# EAGLE design MicroWordClock2_60mm (EAGLE 9.6.2)
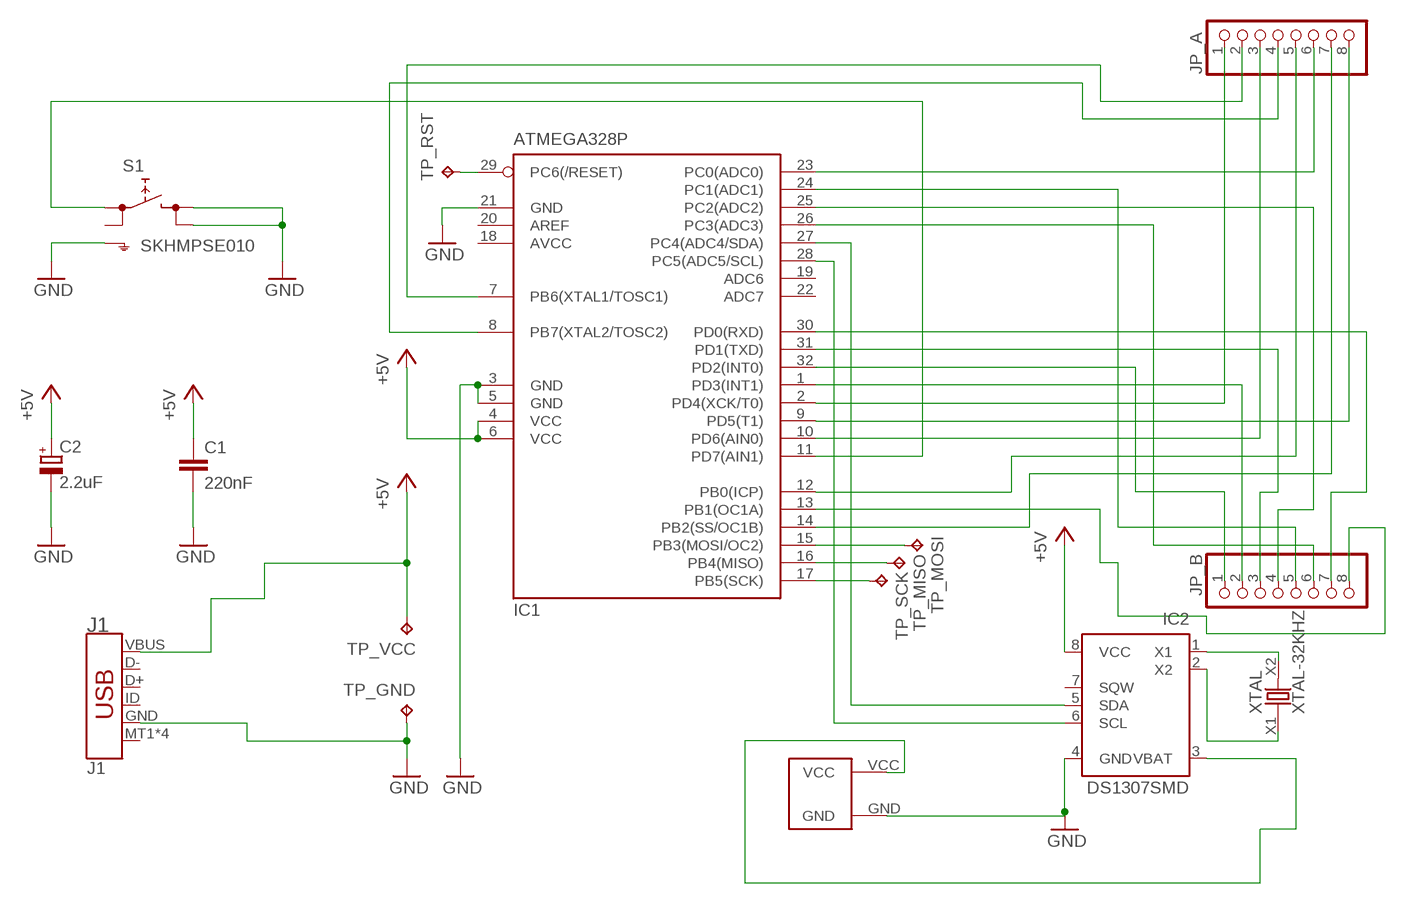
[diagram p0: schematic, sheet 1]

## Parts
C1  220nF  C-EUC0805  [C0805]
C2  2.2uF  CPOL-EUB/3528-21R  [B/3528-21R]
IC1  ATMEGA328P  MEGA8-AI  [TQFP32-08]
IC2  DS1307SMD  [SO-08M]
J1  J1  USB_MICRO-B_SMT  [USB-MICROB]
JP_A  PINHD-1X8CLEANBIG  [1X08-CLEANBIG]
JP_B  PINHD-1X8CLEANBIG  [1X08-CLEANBIG]
S1  SKHMPSE010  [SKHMPXE010]
TP_GND  TPB1,27  [B1,27]
TP_MISO  TPB1,27  [B1,27]
TP_MOSI  TPB1,27  [B1,27]
TP_RST  TPB1,27  [B1,27]
TP_SCK  TPB1,27  [B1,27]
TP_VCC  TPB1,27  [B1,27]
U$1  CR2032  [CR2032-20MM]
XTAL  XTAL-32KHZ  [XTAL-SMD-1206-3216M]

## Nets
+5V: C1.1 C2.+ IC1.4(VCC) IC1.6(VCC) IC2.8(VCC) J1.VBUS TP_VCC.TP
A7: IC1.10(PD6(AIN0)) JP_A.3
A8: IC1.8(PB7(XTAL2/TOSC2)) JP_A.4
B8: IC1.7(PB6(XTAL1/TOSC1)) JP_A.2
GND: C1.2 C2.- IC1.3(GND) IC1.5(GND) IC1.21(GND) IC2.4(GND) J1.GND S1.3(2.1) S1.4(2.2) S1.5(SH) TP_GND.TP U$1.GND
MISO: IC1.16(PB4(MISO)) TP_MISO.TP
MOSI: IC1.15(PB3(MOSI/OC2)) TP_MOSI.TP
N$1: IC1.12(PB0(ICP)) JP_A.5
N$2: IC2.2(X2) XTAL.X1
N$3: IC1.2(PD4(XCK/T0)) JP_A.1
N$4: IC1.23(PC0(ADC0)) JP_A.6
N$5: IC1.14(PB2(SS/OC1B)) JP_A.7
N$6: IC1.9(PD5(T1)) JP_A.8
N$7: IC1.32(PD2(INT0)) JP_B.1
N$8: IC1.1(PD3(INT1)) JP_B.2
N$9: IC1.31(PD1(TXD)) JP_B.3
N$10: IC1.25(PC2(ADC2)) JP_B.4
N$11: IC2.3(VBAT) U$1.VCC
N$12: IC1.24(PC1(ADC1)) JP_B.5
N$13: IC1.26(PC3(ADC3)) JP_B.6
N$14: IC2.1(X1) XTAL.X2
N$15: IC1.30(PD0(RXD)) JP_B.7
N$16: IC1.13(PB1(OC1A)) JP_B.8
N$18: IC1.28(PC5(ADC5/SCL)) IC2.6(SCL)
RESET: IC1.29(PC6(/RESET)) TP_RST.TP
SCK: IC1.17(PB5(SCK)) TP_SCK.TP
SDA: IC1.27(PC4(ADC4/SDA)) IC2.5(SDA)
SWITCH: IC1.11(PD7(AIN1)) S1.1(1.1)
Unconnected: IC1.19(ADC6) IC1.20(AREF) IC1.22(ADC7) IC2.7(SQW) J1.D+ J1.D- J1.ID J1.MT1(SHIELD) J1.MT2(SHIELD) J1.P$1(SHIELD) J1.P$2(SHIELD) S1.2(1.2)

## Power pins joined to a net without a drawn wire
AVCC: IC1.18(AVCC)

## Library data of the parts
C1 = rcl:C-EU: CAPACITOR, European symbol
C2 = rcl:CPOL-EU: POLARIZED CAPACITOR, European symbol
IC1 = atmel:MEGA8: MICROCONTROLLER 8 Kbytes FLASH, 1 kbytes SRAM, 512 bytes EEPROM, USART, 6-channel 10 bit ADC, 2-channel 8 bit ADC Pin compatible with Atmega48, ATMega88, ATMega168 Source: avr.lbr; MPN: ATMEGA8-16AU; OC_FARNELL: 9171371; OC_NEWARK: 73M8863
IC2 = DS1307:DS1307: DS1307 - 64×8, Serial, I2C Real Time Clock
J1 = SparkFun-Connectors:USB_MICRO-B: USB Type Micro-B Connector Male/female and PTH/SMT variants SparkFun Products: SparkFun microB USB Breakout <https://www.sparkfun.com/products/12035> SparkFun USB microB Plug Breakout <https://www.sparkfun.com/products/10031> SparkFun ESP8266 Thing <https://www.sparkfun.com/products/13231>; PROD_ID: CONN-09505; SF_ID: PRT-08533
JP_A JP_B = adafruit:PINHD-1X8: PIN HEADER
S1 = switch:SKHMP*E010: 6.2 X 6.5mm TACT Switch (SMD) Source: http://www3.alps.co.jp/WebObjects/catalog.woa/PDF/E/Switch/Tact/SKHM/SKHM.PDF
TP_GND TP_MISO TP_MOSI TP_RST TP_SCK TP_VCC = testpad:TP: Test pad
U$1 = cr2032:CR2032
XTAL = xtal-32khz:XTAL-32KHZ

## Board
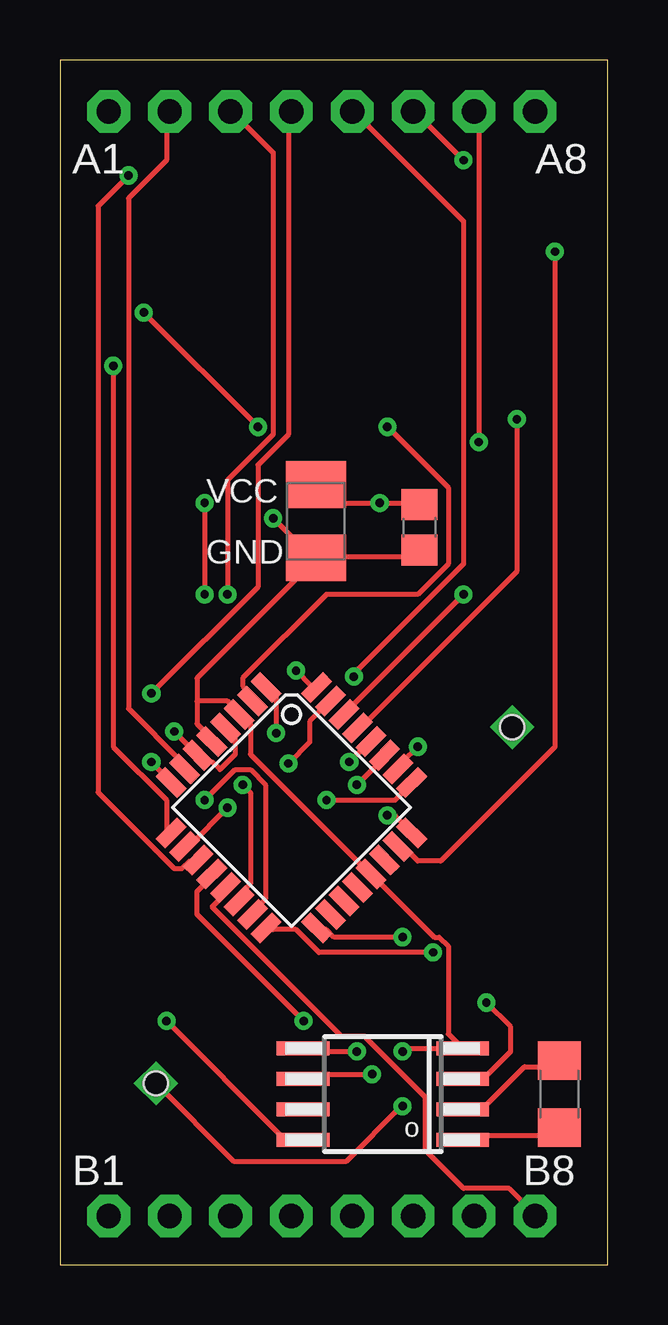
[diagram p1: board, top side]
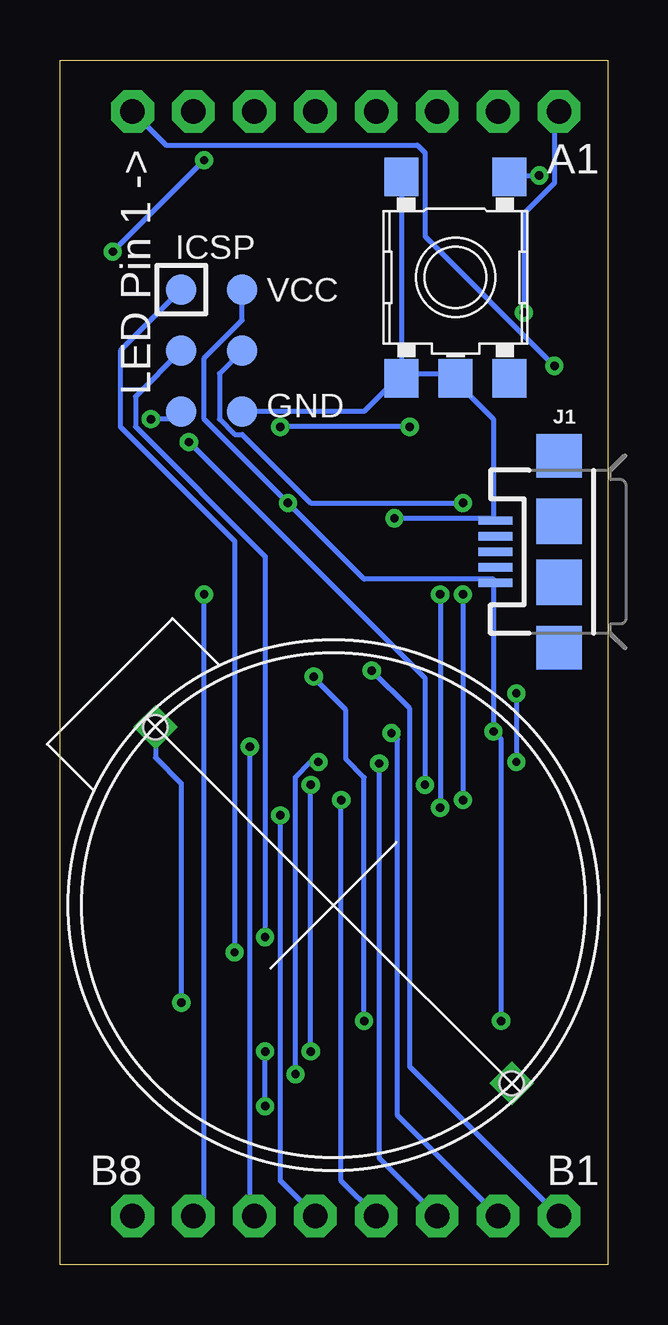
[diagram p2: board, bottom side, seen from below]

Size 22.84 x 50.22 mm. Coordinates in mm from the lower left corner, seen from the top.
Outline: 0,0 22.84,0 22.84,50.22 0,50.22 0,0
Copper layers (1*16): Top 0.035mm / dielectric 1.5mm / Bottom 0.035mm
Design rules "default *": minimum track width 8mil, minimum drill 0.35mm, track to track 6mil, track to pad 6mil, pad to pad 6mil, via to via 6mil, smd to smd 6mil, copper to edge 40mil, drill to drill 6mil, minimum pad ring 10mil, minimum via ring 8mil, stop-mask expansion 4mil, vias tented up to drill 0mil, thermal gap 10mil

### Footprints (pad centres in the part's own frame; a part is rotated, then mirrored left to right if it is on the bottom)
C0805 = smd 1.3 x 1.5: 1 -0.95,0; 2 0.95,0
B/3528-21R = smd 1.95 x 2.5: + 1.525,0; - -1.525,0
TQFP32-08 = smd 1.27 x 0.559: 1 -4.293,2.8; 2 -4.293,2; 3 -4.293,1.2; 4 -4.293,0.4; 5 -4.293,-0.4; 6 -4.293,-1.2; 7 -4.293,-2; 8 -4.293,-2.8; 17 4.293,-2.8; 18 4.293,-2; 19 4.293,-1.2; 20 4.293,-0.4; 21 4.293,0.4; 22 4.293,1.2; 23 4.293,2; 24 4.293,2.8 | smd 0.559 x 1.27: 9 -2.8,-4.293; 10 -2,-4.293; 11 -1.2,-4.293; 12 -0.4,-4.293; 13 0.4,-4.293; 14 1.2,-4.293; 15 2,-4.293; 16 2.8,-4.293; 25 2.8,4.293; 26 2,4.293; 27 1.2,4.293; 28 0.4,4.293; 29 -0.4,4.293; 30 -1.2,4.293; 31 -2,4.293; 32 -2.8,4.293
SO-08M = smd 0.6 x 2.2: 1 -1.905,-3.33; 2 -0.635,-3.33; 3 0.635,-3.33; 4 1.905,-3.33; 5 1.905,3.33; 6 0.635,3.33; 7 -0.635,3.33; 8 -1.905,3.33
USB-MICROB = smd 1.4 x 0.35: D+ -2.65,0; D- -2.65,-0.65; GND -2.65,1.3; ID -2.65,0.65; VBUS -2.65,-1.3 | smd 1.9 x 1.8: MT1 0,-4; MT2 0,4 | smd 1.9 x 1.9: P$1 0,-1.27; P$2 0,1.27
1X08-CLEANBIG = drill 1.016 pad 1.778 octagon: 1 -8.89,0; 2 -6.35,0; 3 -3.81,0; 4 -1.27,0; 5 1.27,0; 6 3.81,0; 7 6.35,0; 8 8.89,0
SKHMPXE010 = smd 1.6 x 1.4: 1 -4.2,2.25; 2 4.2,2.25; 3 -4.2,-2.25; 4 4.2,-2.25; 5 4.2,0
B1,27 = smd 1.27 x 1.27: TP 0,0
CR2032-20MM = drill 0.8 square: GND 0,10.5; VCC 0,-10.5 | hole 1: 0,10.5; 0,-10.5
XTAL-SMD-1206-3216M = smd 1.6 x 1.8: X1 -1.4,0; X2 1.4,0

### Placement (x,y rotation side)
C1  14.99,30.73 270 top
C2  10.67,30.99 90 top
IC1  9.65,19.05 315 top
IC2  13.46,7.11 90 top
J1  2.03,29.72 0 bottom
JP_A  10.92,48.07 0 top
JP_B  10.92,2.03 0 top
S1  6.35,41.15 270 bottom
TP_GND  15.24,35.56 0 bottom
TP_MISO  17.78,40.64 0 bottom
TP_MOSI  15.24,38.1 0 bottom
TP_RST  17.78,35.56 0 bottom
TP_SCK  17.78,38.1 0 bottom
TP_VCC  15.24,40.64 0 bottom
U$1  11.43,14.99 225 bottom
XTAL  20.83,7.11 270 top

### Tracks (layer width: path | path; a pad name or v marks a point on that pad's centre or on a via)
+5V  (via drill 0.35)
  Top 0.203: C1.1 14.92,31.75 v13.34,31.75 11.43,31.75 10.79,32.38 C2.+ | IC1.4 6.99,22.23 7.3,21.91 7.3,21.27 6.67,20.64 6.35,20.95 6.03,20.95 IC1.6 5.71,21.27 v4.76,22.23 | v4.45,10.16 9.21,5.4 9.84,5.4 IC2.8
  Bottom 0.203: TP_VCC.TP 15.24,39.37 16.83,37.78 16.83,35.24 v13.34,31.75 10.16,28.57 4.76,28.57 J1.VBUS 4.76,28.26 v4.76,22.23 4.45,21.91 v4.45,10.16
A7  (via drill 0.35)
  Top 0.203: v6.99,19.05 5.4,17.46 IC1.10 | v6.99,27.94 6.99,32.7 8.89,34.61 8.89,46.35 7.3,47.94 JP_A.3
  Bottom 0.203: v6.99,27.94 v6.99,19.05
A8  (via drill 0.35)
  Top 0.203: v3.81,20.95 4.45,20.32 IC1.8 | v3.81,23.81 8.26,28.26 8.26,33.34 9.53,34.61 9.53,47.94 JP_A.4
  Bottom 0.203: v3.81,23.81 v3.81,20.95
B8
  Top 0.203: IC1.7 5.08,20.95 2.86,23.18 2.86,44.45 4.45,46.04 4.45,47.94 JP_A.2
GND  (via drill 0.35)
  Top 0.203: 5.71,23.5 5.71,24.45 10.48,29.21 C2.- | 5.71,23.5 5.71,22.54 6.03,22.23 6.03,21.91 IC1.5 | C1.2 14.92,29.53 10.79,29.53 C2.- | 5.71,23.5 6.99,23.5 7.3,23.18 IC1.3 7.62,22.86 7.94,22.54 7.94,21.27 12.7,16.51 IC1.21 15.62,13.65 15.82,13.65 16.19,13.28 16.19,9.62 IC2.4 14.41,9.02 v14.29,8.89 | v8.89,31.11 10.48,29.53 C2.- | U$1.GND 7.25,4.32 11.94,4.32 14.22,6.6 v14.29,6.6
  Bottom 0.203: 4.76,31.11 4.76,35.24 6.35,36.83 S1.5 6.35,37.15 8.57,37.15 | TP_GND.TP 10.16,35.56 8.89,36.83 S1.4 8.57,37.15 | 8.57,37.15 8.57,45.09 S1.3 | v8.89,31.11 4.76,31.11 | 4.76,31.11 J1.GND | v14.29,6.6 v14.29,8.89
MISO  (via drill 0.35)
  Top 0.203: v15.56,13.02 10.79,13.02 9.84,13.97 8.89,13.97 IC1.16
  Bottom 0.203: v15.56,13.02 15.56,30.16 20.32,34.92 20.32,38.1 TP_MISO.TP
MOSI  (via drill 0.35)
  Top 0.203: v6.03,19.37 7.3,20.64 7.94,20.64 8.57,20 8.57,15.24 8.26,14.92 8.26,14.61 IC1.15 | v6.03,31.75 v6.03,27.94
  Bottom 0.203: v6.03,27.94 v6.03,19.37 | v6.03,31.75 12.38,31.75 15.24,34.61 15.56,34.61 16.19,35.24 16.19,37.15 TP_MOSI.TP
N$1  (via drill 0.35)
  Top 0.203: v10.16,10.16 5.71,14.61 5.71,15.56 6.03,15.88 6.03,16.19 IC1.12 | v12.26,24.51 12.26,24.64 16.83,29.21 16.83,43.5 12.38,47.94 JP_A.5
  Bottom 0.203: v10.16,10.16 10.16,20.32 10.92,21.08 10.92,23.11 12.19,24.38 12.19,24.45 v12.26,24.51
N$2
  Top 0.203: XTAL.X1 20.64,8.26 19.37,8.26 17.78,6.67 16.83,6.67 IC2.2
N$3  (via drill 0.35)
  Top 0.203: v13.65,34.92 16.19,32.38 16.19,29.21 14.92,27.94 11.11,27.94 7.62,24.45 7.62,24.13 7.94,23.81 IC1.2 | v3.49,39.69 v8.26,34.92
  Bottom 0.203: v8.26,34.92 v13.65,34.92 | v3.49,39.69 3.49,43.81 2.22,45.09 2.22,47.94 JP_A.1
N$4  (via drill 0.35)
  Top 0.203: v20.64,42.23 20.64,21.59 15.88,16.83 14.92,16.83 14.61,17.14 14.29,17.14 IC1.23 | v16.83,46.04 14.92,47.94 JP_A.6
  Bottom 0.203: v16.83,46.04 v20.64,42.23
N$5  (via drill 0.35)
  Top 0.203: v7.62,20 7.94,19.68 7.94,15.88 7.62,15.56 7.62,15.24 IC1.14 | v17.46,34.29 17.46,47.94 JP_A.7
  Bottom 0.203: v7.62,20 7.62,24.45 v17.46,34.29
N$6  (via drill 0.35)
  Top 0.203: v2.22,37.47 2.22,21.59 4.45,19.37 4.45,18.1 IC1.9
  Bottom 0.203: v2.22,37.47 7.62,42.86 7.62,46.35 7.94,46.67 18.41,46.67 JP_A.8
N$7  (via drill 0.35)
  Top 0.203: v9.84,24.77 10.48,24.13 IC1.32
  Bottom 0.203: v9.84,24.77 8.26,23.18 8.26,8.26 JP_B.1
N$8  (via drill 0.35)
  Top 0.203: v9.02,22.16 9.02,23.64 IC1.1
  Bottom 0.203: JP_B.2 8.76,6.22 8.76,21.91 v9.02,22.16
N$9  (via drill 0.35)
  Top 0.203: IC1.31 10.41,22.64 10.41,21.78 v9.53,20.89
  Bottom 0.203: v9.53,20.89 9.53,4.45 JP_B.3
N$10  (via drill 0.35)
  Top 0.203: v11.11,19.37 13.97,19.37 14.61,20 IC1.25
  Bottom 0.203: v11.11,19.37 11.11,3.49 JP_B.4
N$11  (via drill 0.35)
  Top 0.203: IC2.3 17.65,7.75 18.8,8.89 18.8,9.91 v17.78,10.92
  Bottom 0.203: U$1.VCC 18.86,21.14 17.78,20.07 v17.78,10.92
N$12  (via drill 0.35)
  Top 0.203: v13.65,18.73 13.97,18.73 14.61,18.1 IC1.24
  Bottom 0.203: v13.65,18.73 13.65,3.49 JP_B.5
N$13  (via drill 0.35)
  Top 0.203: v14.92,21.59 14.29,20.95 IC1.26
  Bottom 0.203: v14.92,21.59 14.92,2.22 JP_B.6
N$14
  Top 0.203: XTAL.X2 20.64,5.4 16.83,5.4 IC2.1
N$15  (via drill 0.35)
  Top 0.203: v16.83,27.94 12.06,23.18 IC1.30
  Bottom 0.203: v16.83,27.94 16.83,2.54 17.14,2.22 JP_B.7
N$16
  Top 0.203: IC1.13 6.67,15.56 6.67,15.24 6.35,14.92 11.75,9.53 12.7,9.53 15.24,6.99 15.24,4.76 16.83,3.17 18.73,3.17 19.68,2.22 JP_B.8
N$18  (via drill 0.35)
  Top 0.203: v12.06,20.95 12.7,21.59 IC1.28 | v13.02,7.94 10.16,7.94 IC2.6
  Bottom 0.203: v12.06,20.95 12.38,20.95 13.02,20.32 v13.02,7.94
RESET  (via drill 0.35)
  Top 0.203: v19.05,35.24 19.05,28.89 12.7,22.54 IC1.29
  Bottom 0.203: v19.05,35.24 18.1,35.24 TP_RST.TP
SCK  (via drill 0.35)
  Top 0.203: v14.29,13.65 11.43,13.65 11.11,13.97 10.79,13.97 IC1.17
  Bottom 0.203: v14.29,13.65 14.29,29.53 19.68,34.92 19.68,36.2 TP_SCK.TP
SDA  (via drill 0.35)
  Top 0.203: v12.38,20 13.34,20.95 IC1.27 | v12.38,8.89 10.16,8.89 IC2.5
  Bottom 0.203: v12.38,8.89 v12.38,20
SWITCH  (via drill 0.35)
  Top 0.203: v2.86,45.4 1.59,44.13 1.59,19.68 4.76,16.51 5.08,16.51 5.4,16.83 5.71,16.83 IC1.11
  Bottom 0.203: v2.86,45.4 3.81,45.4 S1.1

### Text on the board
tPlace: A1 | A8 | VCC | GND | o | B1 | B8
bPlace: LED Pin 1 -> | A1 | ICSP | VCC | GND | B1 | B8